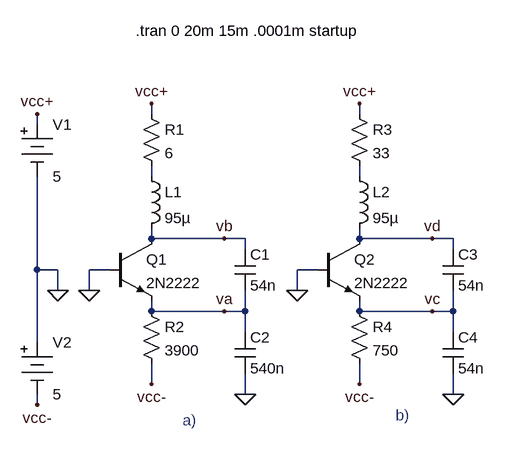
[diagram p0: schematic colpitts caos y no caos.asc]
colpitts caos y no caos.asc, the LTspice schematic file:
Version 4
SHEET 1 1684 680
WIRE 208 -80 208 -96
WIRE 528 -80 528 -96
WIRE 32 -64 32 -80
WIRE 208 16 208 0
WIRE 528 16 528 0
WIRE 208 112 208 96
WIRE 320 112 208 112
WIRE 352 112 320 112
WIRE 528 112 528 96
WIRE 640 112 528 112
WIRE 672 112 640 112
WIRE 352 128 352 112
WIRE 672 128 672 112
WIRE 32 160 32 16
WIRE 64 160 32 160
WIRE 144 160 112 160
WIRE 464 160 432 160
WIRE 64 192 64 160
WIRE 112 192 112 160
WIRE 432 192 432 160
WIRE 208 224 208 208
WIRE 320 224 208 224
WIRE 352 224 352 192
WIRE 352 224 320 224
WIRE 528 224 528 208
WIRE 640 224 528 224
WIRE 672 224 672 192
WIRE 672 224 640 224
WIRE 352 256 352 224
WIRE 672 256 672 224
WIRE 32 272 32 160
WIRE 208 336 208 304
WIRE 528 336 528 304
WIRE 352 352 352 320
WIRE 672 352 672 320
WIRE 32 368 32 352
FLAG 672 352 0
FLAG 432 192 0
FLAG 640 224 vc
FLAG 640 112 vd
FLAG 352 352 0
FLAG 112 192 0
FLAG 320 224 va
FLAG 320 112 vb
FLAG 32 -80 vcc+
FLAG 208 -96 vcc+
FLAG 528 -96 vcc+
FLAG 32 368 vcc-
FLAG 208 336 vcc-
FLAG 528 336 vcc-
FLAG 64 192 0
SYMBOL npn 464 112 R0
SYMATTR InstName Q2
SYMATTR Value 2N2222
SYMBOL ind 512 0 R0
SYMATTR InstName L2
SYMATTR Value 95µ
SYMBOL res 512 -96 R0
SYMATTR InstName R3
SYMATTR Value 33
SYMBOL res 512 208 R0
SYMATTR InstName R4
SYMATTR Value 750
SYMBOL cap 656 128 R0
SYMATTR InstName C3
SYMATTR Value 54n
SYMBOL cap 656 256 R0
SYMATTR InstName C4
SYMATTR Value 54n
SYMBOL npn 144 112 R0
SYMATTR InstName Q1
SYMATTR Value 2N2222
SYMBOL ind 192 0 R0
SYMATTR InstName L1
SYMATTR Value 95µ
SYMBOL res 192 -96 R0
SYMATTR InstName R1
SYMATTR Value 6
SYMBOL res 192 208 R0
SYMATTR InstName R2
SYMATTR Value 3900
SYMBOL cap 336 128 R0
SYMATTR InstName C1
SYMATTR Value 54n
SYMBOL cap 336 256 R0
SYMATTR InstName C2
SYMATTR Value 540n
SYMBOL Misc\\battery 32 -80 R0
WINDOW 123 0 0 Left 0
WINDOW 39 0 0 Left 0
SYMATTR InstName V1
SYMATTR Value 5
SYMBOL Misc\\battery 32 256 R0
WINDOW 123 0 0 Left 0
WINDOW 39 0 0 Left 0
SYMATTR InstName V2
SYMATTR Value 5
TEXT 184 -208 Left 2 !.tran 0 20m 15m .0001m startup
TEXT 256 392 Left 2 ;a)
TEXT 584 384 Left 2 ;b)

The netlist it stands for:
* colpitts caos y no caos.asc
Q2 vd 0 vc 0 2N2222
L2 N002 vd 95µ
R3 vcc+ N002 33
R4 vc vcc- 750
C3 vd vc 54n
C4 vc 0 54n
Q1 vb 0 va 0 2N2222
L1 N001 vb 95µ
R1 vcc+ N001 6
R2 va vcc- 3900
C1 vb va 54n
C2 va 0 540n
V1 vcc+ 0 5
V2 0 vcc- 5
.model NPN NPN
.model PNP PNP
.lib standard.bjt
.tran 0 20m 15m .0001m startup
* a)
* b)
.backanno
.end